# Altium schematic sheet current_sensor_power.SchDoc
size A
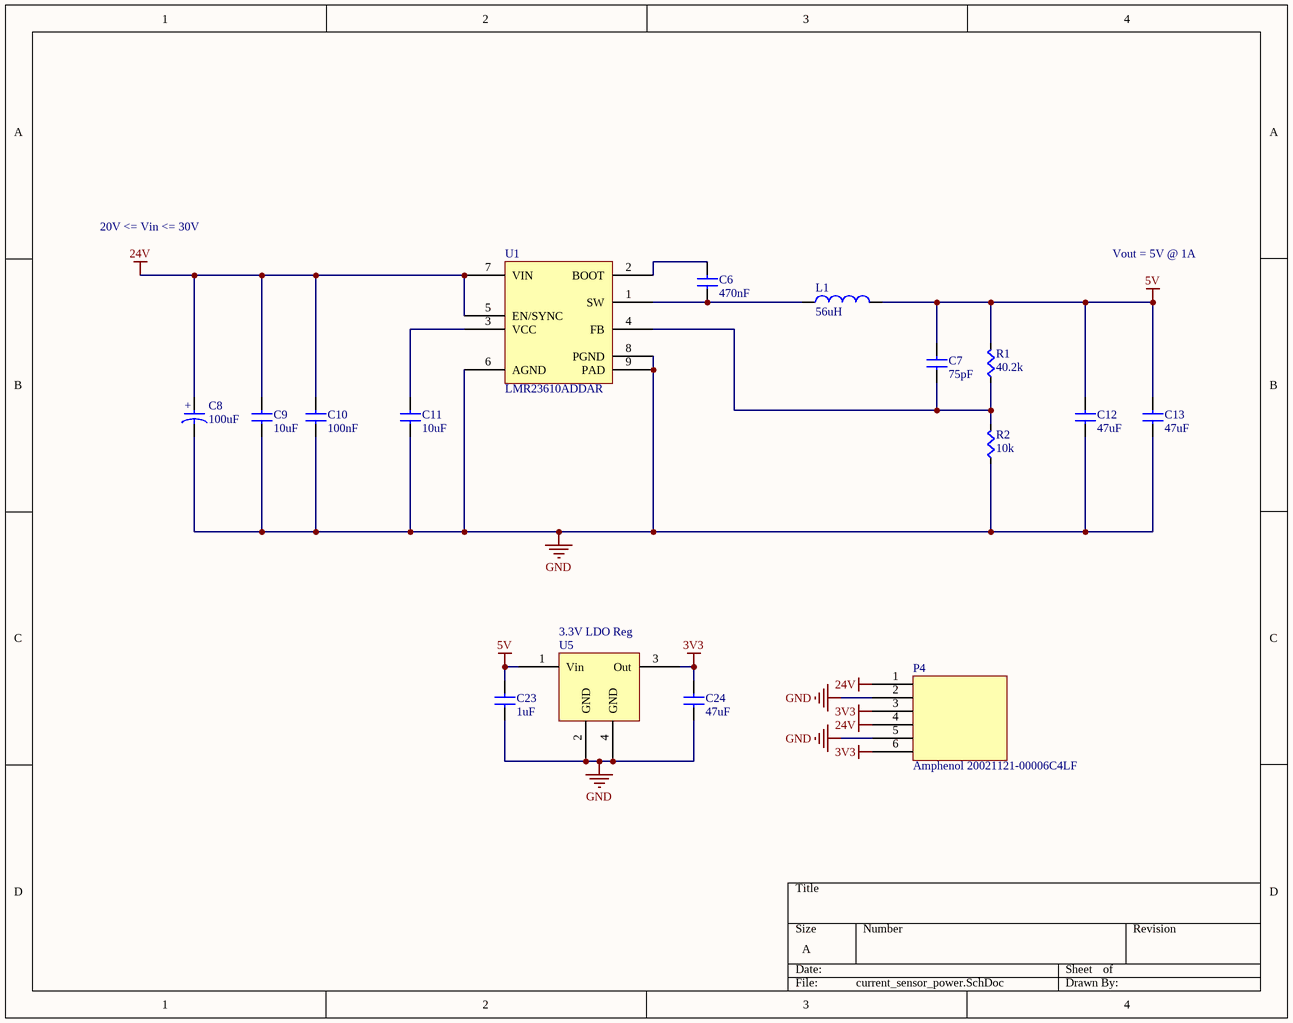
[diagram p0: current_sensor_power.SchDoc]

## Parts
C6  value 470nF  [CAPC0603]  (hidden comment: Cap)
C7  value 75pF  [CAPC0603]  (hidden comment: Cap)
C8  value 100uF  [EEHZA1H101P]  (hidden comment: EEHZA1H101P)
C9  value 10uF  [CAP1210]  (hidden comment: Cap)
C10  value 100nF  [CAPC0603]  (hidden comment: Cap)
C11  value 10uF  [CAPC0603]  (hidden comment: Cap)
C12  value 47uF  [CAP1210]  (hidden comment: Cap)
C13  value 47uF  [CAP1210]  (hidden comment: Cap)
C23  value 1uF  [CAPC0603]  (hidden comment: Cap)
C24  value 47uF  [CAPC0603]  (hidden comment: Cap)
L1  value 56uH  [MSS1048-563MLB]  (hidden comment: MSS1048-563MLB)
P4  Amphenol 20021121-00006C4LF  [Amphenol FCI 20021121-00006C4LF]
R1  value 40.2k  [RES0603]  (hidden comment: Res)
R2  value 10k  [RES0603]  (hidden comment: Res)
U1  LMR23610ADDAR  [LMR23610ADDAR]
U5  3.3V LDO Reg  [SOT23-4n]

## Nets
3V3: C24.1(A) P4.3 P4.6 U5.3(Out)
5V: C7.1(A) C12.1(A) C13.1(A) C23.1(A) L1.2 R1.1(A) U5.1(Vin)
24V: C8.1 C9.1(A) C10.1(A) P4.1 P4.4 U1.5(EN/SYNC) U1.7(VIN)
GND: C8.2 C9.2(B) C10.2(B) C11.2(B) C12.2(B) C13.2(B) C23.2(B) C24.2(B) P4.2 P4.5 R2.2(B) U1.6(AGND) U1.8(PGND) U1.9(PAD) U5.2(GND) U5.4(GND)
NetC6_1: C6.1(A) U1.2(BOOT)
NetC6_2: C6.2(B) L1.1 U1.1(SW)
NetC7_2: C7.2(B) R1.2(B) R2.1(A) U1.4(FB)
NetC11_1: C11.1(A) U1.3(VCC)

## Notes on the sheet
- 20V <= Vin <= 30V
- Vout = 5V @ 1A
- (in symbol EEHZA1H101P) +

## Library data of the parts
C8 = EEHZA1H101P: CAP ALUM POLY HYB 100UF 50V SMD; Manufacturer 1: Panasonic; Tolerance: 20%; Supplier 1: Digi-Key; Supplier Part Number 1: P15442CT-ND; Manufacturer Part Number 1: EEHZA1H101P; Voltage: 50V; ComponentLink1URL: https://na.industrial.panasonic.com/products/capacitors/aluminum-electrolytic-capacitors/conductive-polymer-hybrid-aluminum-electrolytic/series/za-high-temp-reflow/ABA0135/model/EEHZA1H101P; ComponentLink1Description: Web Site; ComponentLink2URL: https://industrial.panasonic.com/cdbs/www-data/pdf/RDD0000/ABA0000C1221.pdf; ComponentLink2Description: Data Sheet; ComponentLink3URL: https://industrial.panasonic.com/cdbs/www-data/pdf/RDD0000/ABA0000COS44.pdf; ComponentLink3Description: ZA Series Technical Data
C23 C24 = Cap: Manufacturer Part Number: C0603C105K8PACTU; Supplier 1: Digi-Key; Supplier Part Number 1: 399-3118-1-ND
L1 = MSS1048-563MLB: FIXED IND 56UH 1.7A 126 MOHM; Manufacturer 1: Coilcraft; Manufacturer Part Number 1: MSS1048-563MLB; ComponentLink1Description: Web Site; ComponentLink1URL: https://www.coilcraft.com/mss1048.cfm; Supplier 1: Coilcraft; Supplier Part Number 1: MSS1048-563MLB
P4 = Amphenol FCI 20021121-00006C4LF: 6 Positions Header Connector 0.050" (1.27mm) Surface Mount Gold; Manufacturer 1: Amphenol FCI; Manufacturer Part Number 1: 20021121-00006C4LF; Supplier 1: Digi-Key; Supplier Part Number 1: 609-3693-1-ND; ComponentLink1URL: *; ComponentLink1URL: https://www.digikey.com/product-detail/en/amphenol-fci/20021321-00006C4LF/609-3704-1-ND/2209148; ComponentLink1Description: Website; ComponentLink1URL: https://www.digikey.com/product-detail/en/amphenol-fci/20021121-00006C4LF/609-3693-1-ND/2209145; System: Connector
U1 = LMR23610ADDAR: IC REG BUCK ADJ 1A SYNC 8SOPWRPD; Manufacturer 1: Texas Instruments; Supplier 1: Digi-Key; Supplier Part Number 1: 296-47267-1-ND; Manufacturer Part Number 1: LMR23610ADDAR; ComponentLink1URL: http://www.ti.com/lit/ds/symlink/lmr23610.pdf; ComponentLink1Description: Datasheet; ComponentLink2URL: http://www.ti.com/product/LMR23610/description; ComponentLink2Description: Web Site
U5 = LM3940IMPX-3.3: IC REG LDO 3.3V 1A SOT223; Supplier 1: Digi-Key; Supplier Part Number 1: LM3940IMPX-3.3/NOPBCT-ND
C6 C7 C9-C13 = Cap: Supplier 1: Digi-Key
  C6: Supplier Part Number 1: 399-7934-2-ND
  C7: Supplier Part Number 1: 399-15423-2-ND
  C9 C11: Supplier Part Number 1: 399-15352-2-ND
  C10: Supplier Part Number 1: 399-7374-2-ND
  C12 C13: Supplier Part Number 1: 399-5516-2-ND
R1 R2 = Res: Supplier 1: Digi-Key
  R1: Supplier Part Number 1: RMCF0603FT40K2CT-ND
  R2: Supplier Part Number 1: RMCF0603JT10K0CT-ND